# Altium project INT.PrjPCB
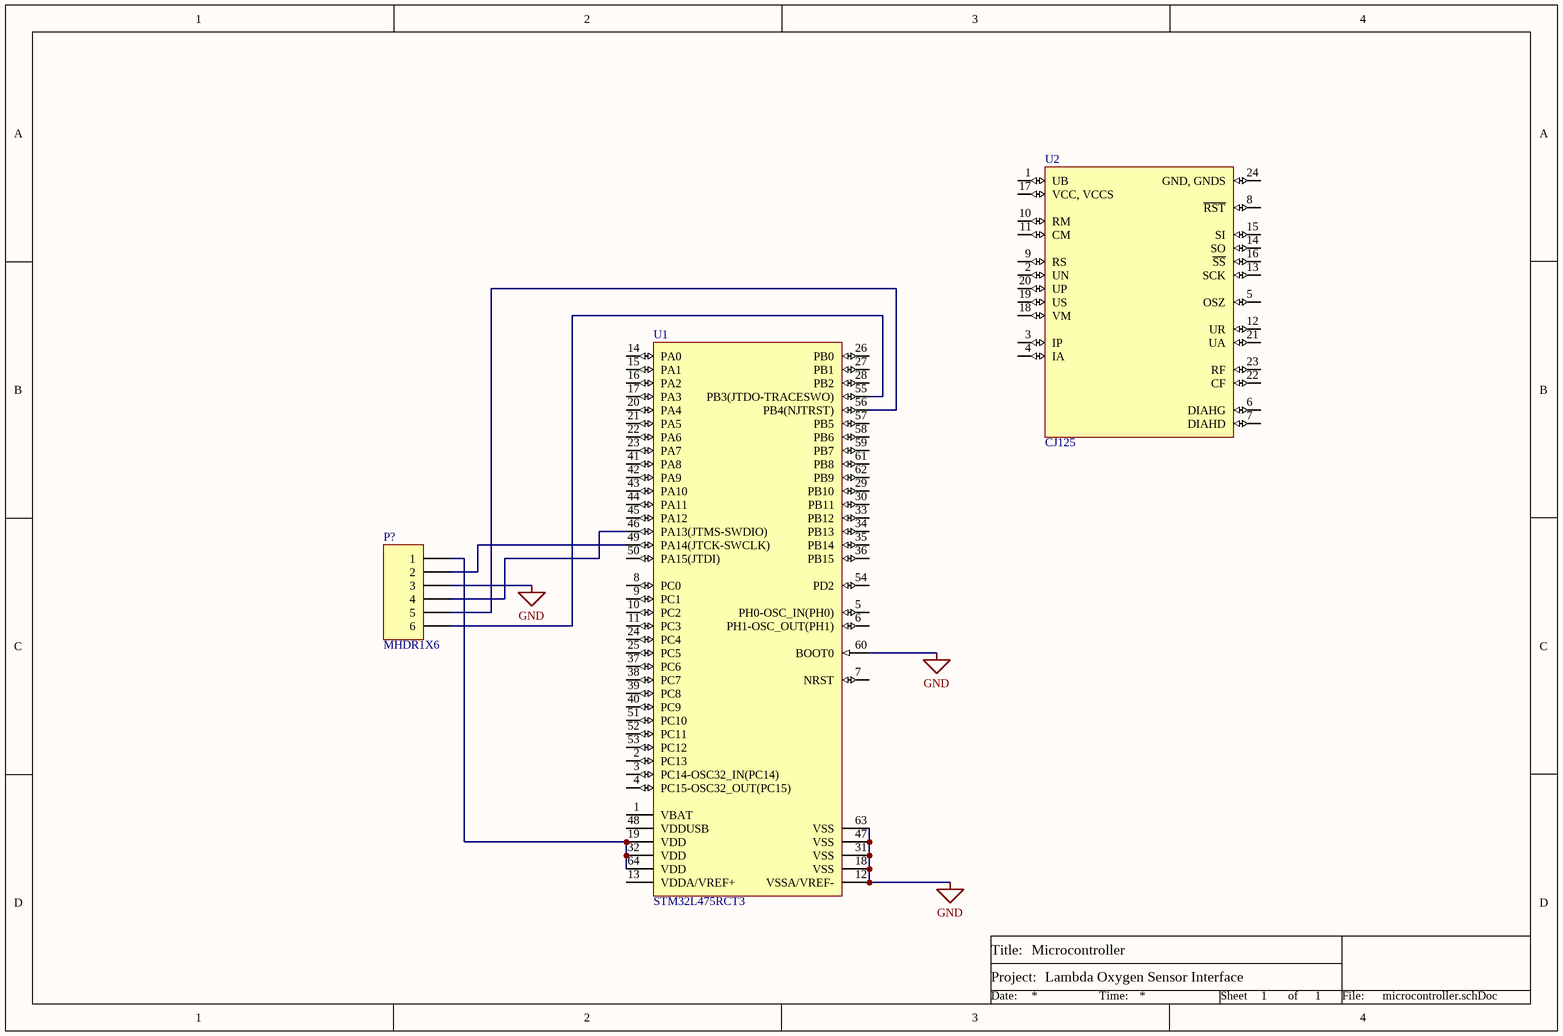
[diagram p0: microcontroller.schDoc]
ProjectTitle: Lambda Oxygen Sensor Interface
1 sheet, 3 parts. Net scope: global (net labels, ports and power ports of the same name join across sheets).
Board file: pcb.PcbDoc

## Sheet microcontroller.schDoc: Microcontroller
size A4; SheetNumber: 1; SheetTotal: 1

### Parts
P?  MHDR1X6  [MHDR1X6]
U1  STM32L475RCT3  [STM-LQFP64_L]
U2  CJ125  [SOIC-24]

### Nets
GND: P?.3 U1.12(VSSA/VREF-) U1.18(VSS) U1.31(VSS) U1.47(VSS) U1.60(BOOT0) U1.63(VSS)
NetP?_1: P?.1 U1.19(VDD) U1.32(VDD) U1.64(VDD)
NetP?_2: P?.2 U1.49(PA14(JTCK-SWCLK))
NetP?_4: P?.4 U1.46(PA13(JTMS-SWDIO))
NetP?_5: P?.5 U1.56(PB4(NJTRST))
NetP?_6: P?.6 U1.55(PB3(JTDO-TRACESWO))

Not connected (* = marked no-connect by the designer): U1 1(VBAT) 2(PC13) 3(PC14-OSC32_IN(PC14)) 4(PC15-OSC32_OUT(PC15)) 5(PH0-OSC_IN(PH0)) 6(PH1-OSC_OUT(PH1)) 7(NRST) 8(PC0) 9(PC1) 10(PC2) 11(PC3) 13(VDDA/VREF+) 14(PA0) 15(PA1) 16(PA2) 17(PA3) 20(PA4) 21(PA5) 22(PA6) 23(PA7) 24(PC4) 25(PC5) 26(PB0) 27(PB1) 28(PB2) 29(PB10) 30(PB11) 33(PB12) 34(PB13) 35(PB14) 36(PB15) 37(PC6) 38(PC7) 39(PC8) 40(PC9) 41(PA8) 42(PA9) 43(PA10) 44(PA11) 45(PA12) 48(VDDUSB) 50(PA15(JTDI)) 51(PC10) 52(PC11) 53(PC12) 54(PD2) 57(PB5) 58(PB6) 59(PB7) 61(PB8) 62(PB9); U2 1(UB) 2(UN) 3(IP) 4(IA) 5(OSZ) 6(DIAHG) 7(DIAHD) 8(~{RST}) 9(RS) 10(RM) 11(CM) 12(UR) 13(SCK) 14(SO) 15(SI) 16(~{SS}) 17(VCC,_VCCS) 18(VM) 19(US) 20(UP) 21(UA) 22(CF) 23(RF) 24(GND,_GNDS)

### Notes on the sheet
- Title:
- Project:
- Date:
- Time:
- Sheet
- of
- File:
- Title
- Size:
- E
- Number:
- Revision:

### Library data of the parts
P? = MHDR1X6: Header, 6-Pin; LatestRevisionDate: 17-Jul-2002; LatestRevisionNote: Re-released for DXP Platform.; Publisher: Altium Limited
U1 = STM32L475RCT3: Ultra-Low-Power ARM Cortex-M4 32-bit MCU+FPU, 256 KB Flash, 128 KB Internal RAM, 51 I/Os, 64-Pin LQFP, -40 to 125 degC, Tray; Operating Frequency(F) (Processor speed) (MHz): 80; Internal RAM Size (kB): 128; I/Os (High Current): 51; D/A Converter: 2; Supply Voltage(Vcc) min (V): 1.71; FLASH Size (Prog) (kB): 256; Package: LQFP64; Packing: Tray; DatasheetVersion: Rev. 4; Mounting Technology: Surface Mount; Core: ARM Cortex-M4; Package Description: 64-Pin Low-profile Quad Flat Package, Body 10 x 10 mm, Pitch 0.5 mm; ComponentLink1Description: Datasheet; ComponentLink1URL: http://www.st.com/content/ccc/resource/technical/document/datasheet/90/51/73/d2/53/60/4f/5f/DM00172872.pdf/files/DM00172872.pdf/jcr:content/translations/en.DM00172872.pdf; Supplier 1: Digi-Key; Supplier Part Number 1: 497-16840-ND
U2 = CJ125: 5V 2Mbaud SMT Lambda Probe Interface IC - SOIC-24; Supplier 1: Future Electronics; Package Reference: SOIC-24; Supplier Part Number 1: 0272240104